# Altium schematic sheet Sheet1.SchDoc
size A
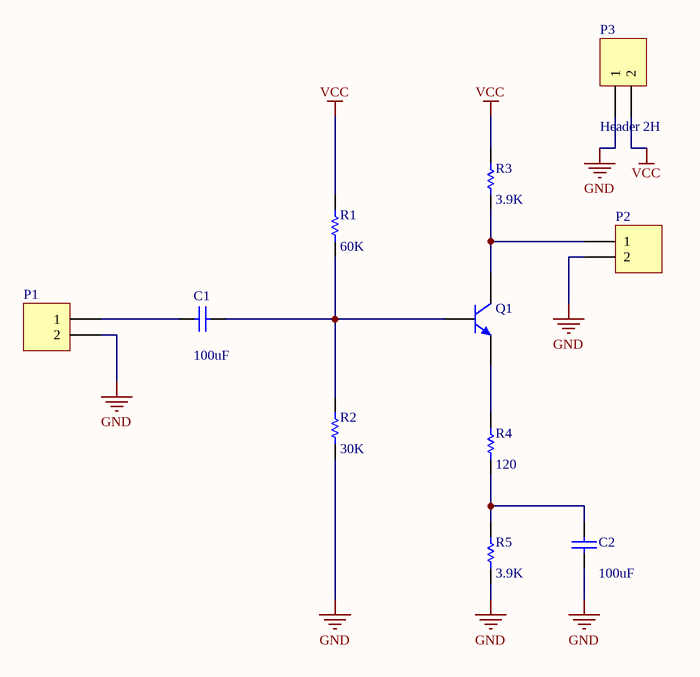
[diagram p0: Sheet1.SchDoc]

## Parts
C1  value 100uF  [RAD-0.3]  (hidden comment: Cap)
C2  value 100uF  [RAD-0.3]  (hidden comment: Cap)
P1  Header 2H  [HDR1X2H]  (value not drawn)
P2  Header 2H  [HDR1X2H]  (value not drawn)
P3  Header 2H  [HDR1X2H]
Q1  BC548C  [29-04]  (value not drawn)
R1  value 60K  [AXIAL-0.3]  (hidden comment: Res1)
R2  value 30K  [AXIAL-0.3]  (hidden comment: Res1)
R3  value 3.9K  [AXIAL-0.3]  (hidden comment: Res1)
R4  value 120  [AXIAL-0.3]  (hidden comment: Res1)
R5  value 3.9K  [AXIAL-0.3]  (hidden comment: Res1)

## Nets
GND: C2.1 P1.2 P2.2 P3.1 R2.1 R5.1
VCC: P3.2 R1.2 R3.2
NetC1_1: C1.1 P1.1
NetC1_2: C1.2 Q1.2(B) R1.1 R2.2
NetC2_2: C2.2 R4.1 R5.2
NetP2_1: P2.1 Q1.1(C) R3.1
NetQ1_3: Q1.3(E) R4.2

## Library data of the parts
C1 C2 = Cap: Capacitor; Published: 8-Jun-2000; LatestRevisionDate: 17-Jul-2002; LatestRevisionNote: Re-released for DXP Platform.; PackageReference: RAD-0.3; Publisher: Altium Limited; PackageDescription: Radial Cap, Thru-Hole; 2 Leads; 0.3 in Pin Spacing
P1-P3 = Header 2H: Header, 2-Pin, Right Angle; LatestRevisionDate: 17-Jul-2002; LatestRevisionNote: Re-released for DXP Platform.; Publisher: Altium Limited
Q1 = BC548C: Amplifier Transistor NPN Silicon; Published: 29-Sep-2000; LatestRevisionDate: 17-Jul-2002; LatestRevisionNote: Re-released for DXP Platform.; DatasheetVersion: 1991; PackageVersion: 1996; PackageReference: 29-04; Publisher: Altium Limited; PackageDescription: TO, Flat Index; 3 In-Line, Axial Leads; Body Dia. 4.8mm; Leads 0.48 x 0.5 mm (max); ComponentLink1Description: Manufacturer Link; ComponentLink1URL: http://www.onsemi.com/site/products/landing?taxonomyID=194; ComponentLink2Description: Datasheet; ComponentLink2URL: http://www.onsemi.com/pub/Collateral/BC546-D.PDF
R1-R5 = Res1: Resistor; Published: 8-Jun-2000; LatestRevisionDate: 17-Jul-2002; LatestRevisionNote: Re-released for DXP Platform.; PackageReference: AXIAL-0.3; Publisher: Altium Limited; PackageDescription: Axial Device, Thru-Hole; 2 Leads; 0.3 in Pin Spacing